# EAGLE design attenuverter (EAGLE 7.6.0)
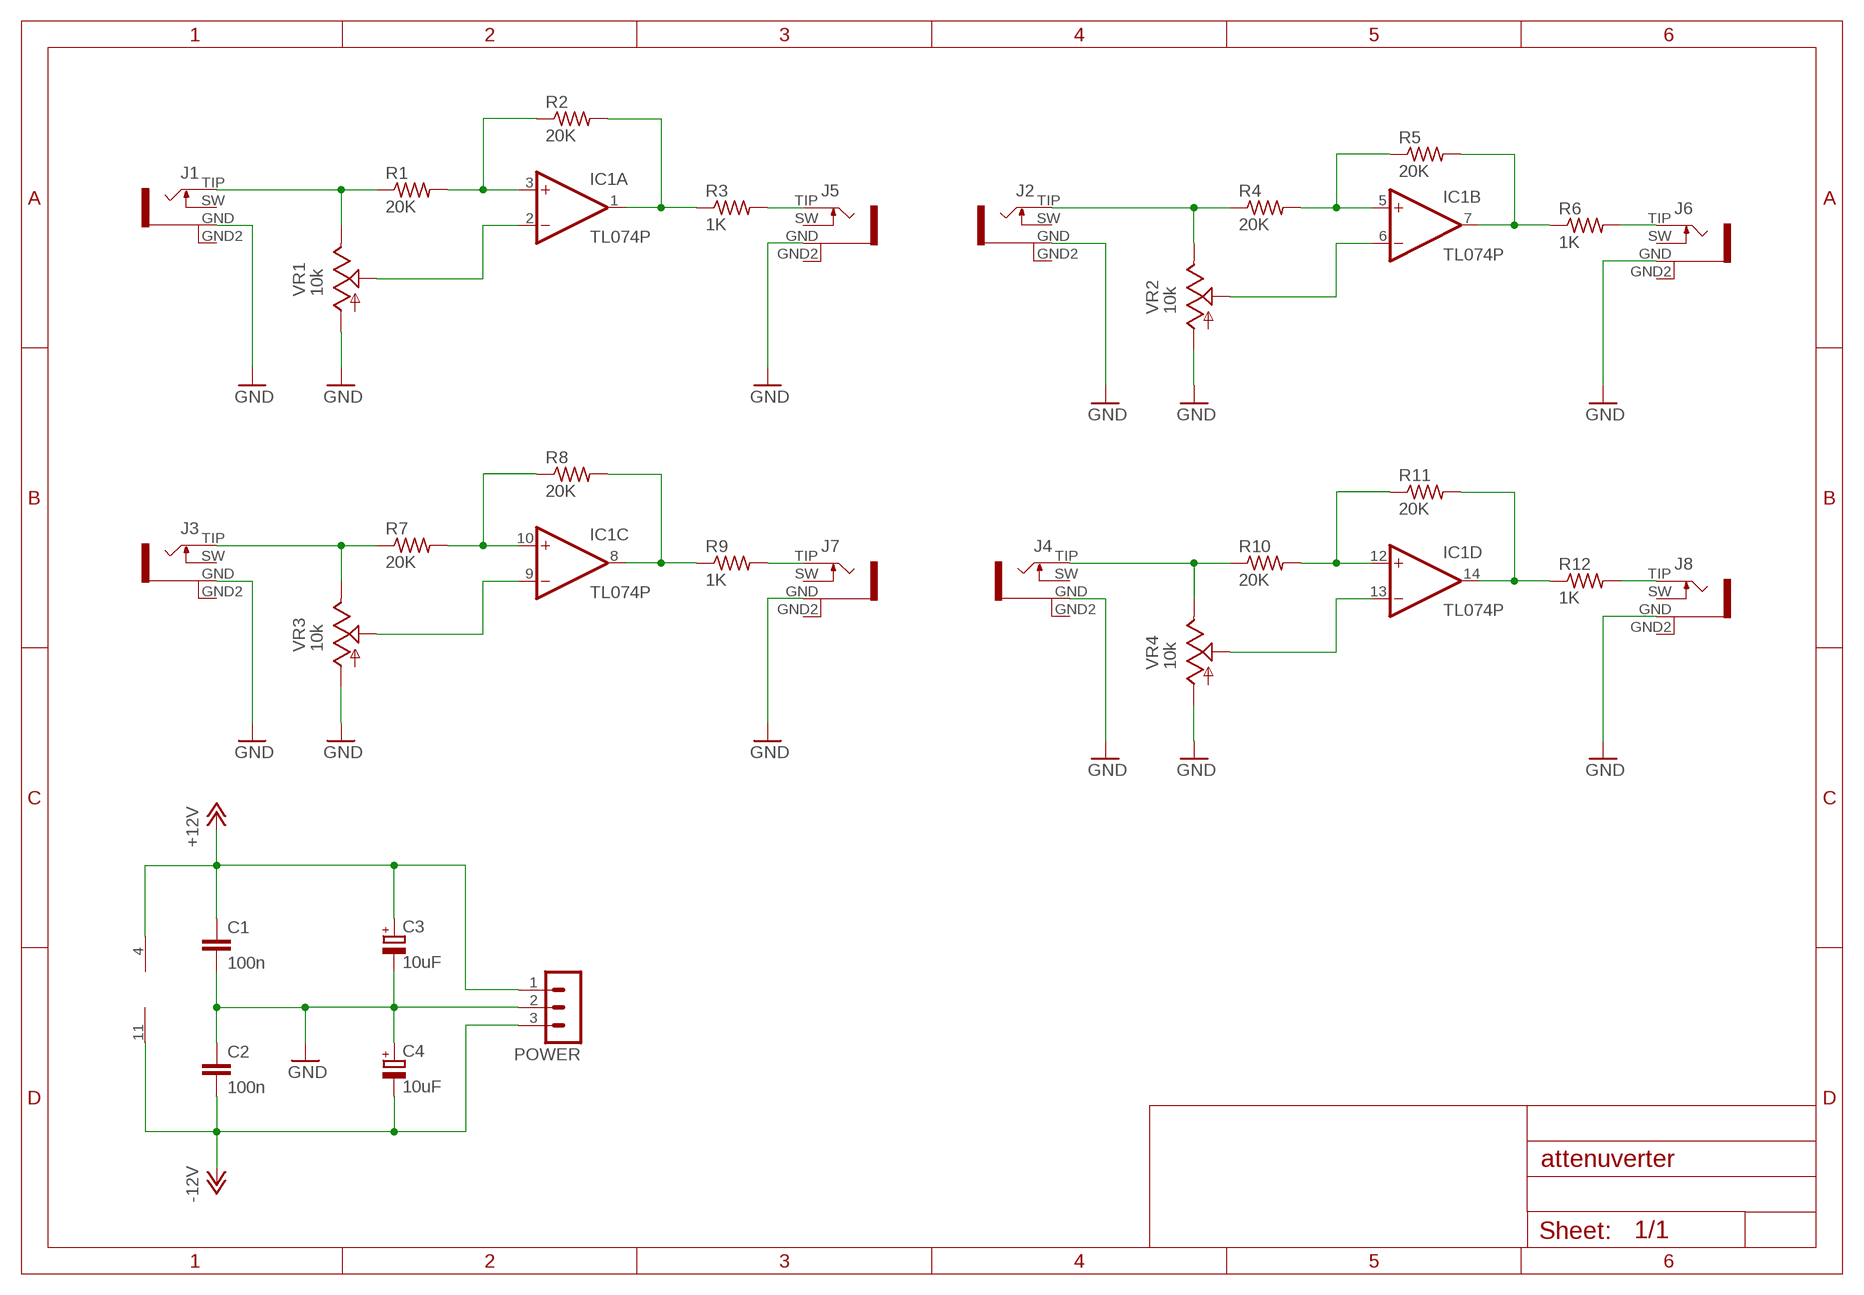
[diagram p0: schematic, sheet 1]

## Parts
C1  100n  C-EU025-025X050  [C025-025X050]
C2  100n  C-EU025-025X050  [C025-025X050]
C3  10uF  CPOL-EUE2,5-6E  [E2,5-6E]
C4  10uF  CPOL-EUE2,5-6E  [E2,5-6E]
IC1  TL074P  [DIL14]
J1  PJ301WQP  [THONK_JACK_P]
J2  PJ301WQP  [THONK_JACK_P]
J3  PJ301WQP  [THONK_JACK_P]
J4  PJ301WQP  [THONK_JACK_P]
J5  PJ301WQP  [THONK_JACK_P]
J6  PJ301WQP  [THONK_JACK_P]
J7  PJ301WQP  [THONK_JACK_P]
J8  PJ301WQP  [THONK_JACK_P]
POWER  MA03-1  [MA03-1]
R1  20K  R-US_0207/10  [0207/10]
R2  20K  R-US_0207/10  [0207/10]
R3  1K  R-US_0207/10  [0207/10]
R4  20K  R-US_0207/10  [0207/10]
R5  20K  R-US_0207/10  [0207/10]
R6  1K  R-US_0207/10  [0207/10]
R7  20K  R-US_0207/10  [0207/10]
R8  20K  R-US_0207/10  [0207/10]
R9  1K  R-US_0207/10  [0207/10]
R10  20K  R-US_0207/10  [0207/10]
R11  20K  R-US_0207/10  [0207/10]
R12  1K  R-US_0207/10  [0207/10]
VR1  10k  9MM_SNAP-IN_POT_  [9MM_SNAP-IN_POT]
VR2  10k  9MM_SNAP-IN_POT_  [9MM_SNAP-IN_POT]
VR3  10k  9MM_SNAP-IN_POT_  [9MM_SNAP-IN_POT]
VR4  10k  9MM_SNAP-IN_POT_  [9MM_SNAP-IN_POT]

## Nets
+12V: C1.1 C3.+ IC1.4(P:V+) POWER.1
-12V: C2.2 C4.- IC1.11(P:V-) POWER.3
GND: C1.2 C2.1 C3.- C4.+ J1.GND J2.GND J3.GND J4.GND J5.GND J6.GND J7.GND J8.GND POWER.2 VR1.1(A) VR2.1(A) VR3.1(A) VR4.1(A)
N$1: J1.TIP R1.1 VR1.3(E)
N$2: J3.TIP R7.1 VR3.3(E)
N$3: IC1.10(C:+IN) R7.2 R8.1
N$4: IC1.3(A:+IN) R1.2 R2.1
N$5: IC1.1(A:OUT) R2.2 R3.1
N$6: J5.TIP R3.2
N$7: IC1.8(C:OUT) R8.2 R9.1
N$8: J7.TIP R9.2
N$9: IC1.12(D:+IN) R10.2 R11.1
N$10: J4.TIP R10.1 VR4.3(E)
N$11: IC1.5(B:+IN) R4.2 R5.1
N$12: J2.TIP R4.1 VR2.3(E)
N$13: IC1.7(B:OUT) R5.2 R6.1
N$14: J6.TIP R6.2
N$15: IC1.14(D:OUT) R11.2 R12.1
N$16: J8.TIP R12.2
N$17: IC1.2(A:-IN) VR1.2(S)
N$18: IC1.9(C:-IN) VR3.2(S)
N$19: IC1.6(B:-IN) VR2.2(S)
N$20: IC1.13(D:-IN) VR4.2(S)
Unconnected: J1.GND2 J1.SW J2.GND2 J2.SW J3.GND2 J3.SW J4.GND2 J4.SW J5.GND2 J5.SW J6.GND2 J6.SW J7.GND2 J7.SW J8.GND2 J8.SW

## Library data of the parts
C1 C2 = resistor:C-EU: CAPACITOR, European symbol
C3 C4 = resistor:CPOL-EU: POLARIZED CAPACITOR, European symbol
IC1 = linear:TL074: OP AMP
J1-J8 = tim:PJ301
POWER = con-lstb:MA03-1: PIN HEADER; OC_FARNELL: unknown; OC_NEWARK: unknown
R1-R12 = resistor:R-US_: RESISTOR, American symbol
VR1-VR4 = MusicThingModular:9MM_SNAP-IN_POT: 9mm vertical snap-in pot, Alpha / Panasonic style

## Board
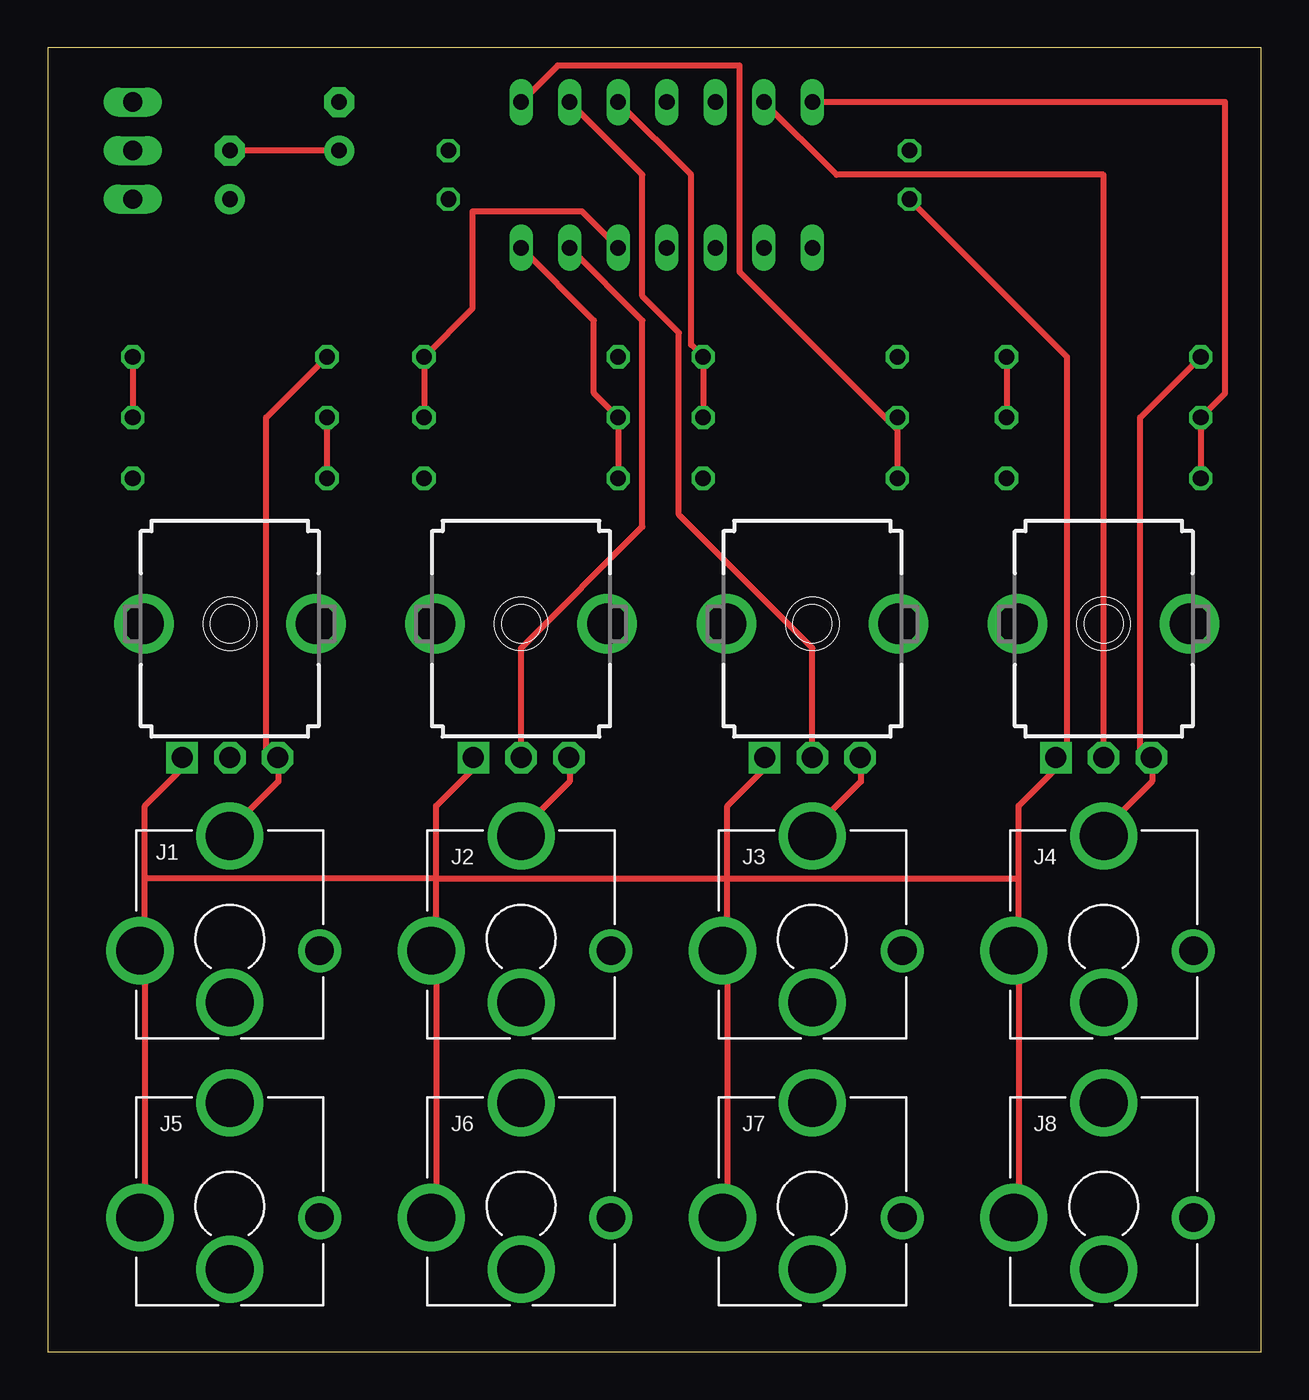
[diagram p1: board, top side]
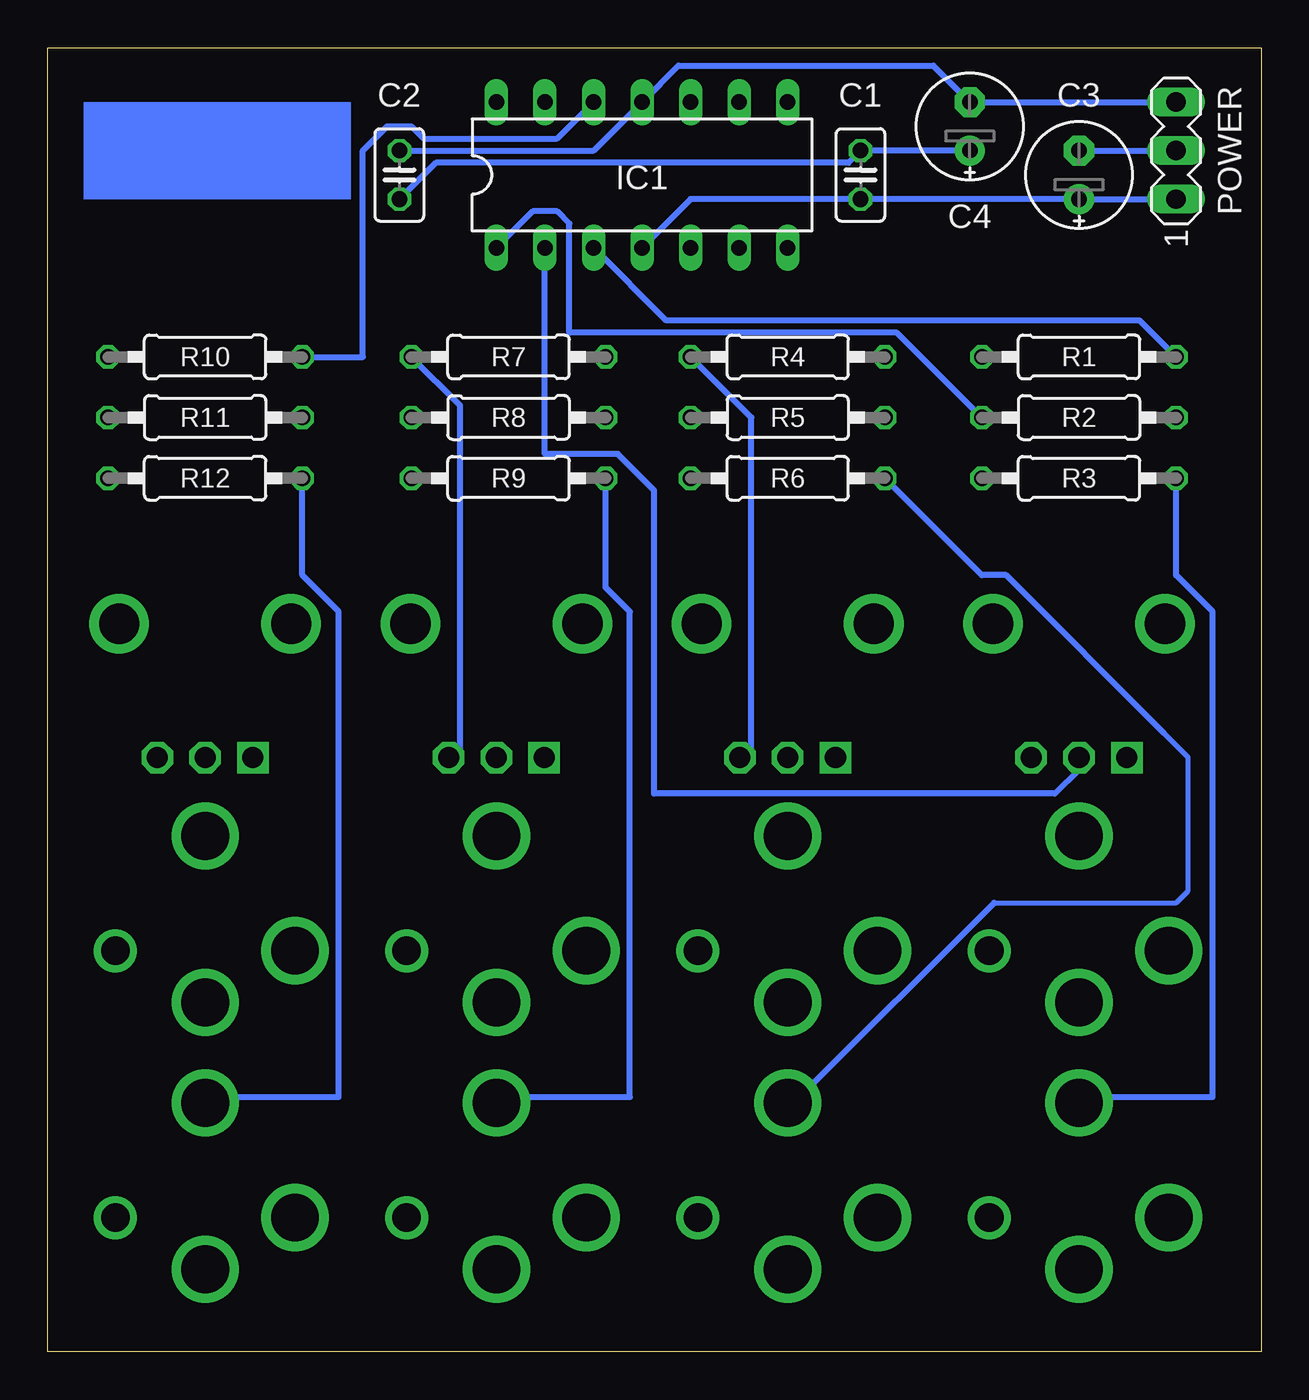
[diagram p2: board, bottom side, seen from below]

Size 63.48 x 68.25 mm. Coordinates in mm from the lower left corner, seen from the top.
Outline: 0,0 63.48,0 63.48,68.25 0,68.25 0,0
Copper layers (1*16): Top 0.035559375mm / dielectric 1.6mm / Bottom 0.035559375mm
Design rules "jlcpcb2layer *": minimum track width 12mil, minimum drill 12mil, track to track 12mil, track to pad 12mil, pad to pad 12mil, via to via 12mil, smd to smd 12mil, copper to edge 12mil, drill to drill 12mil, minimum pad ring 5mil, minimum via ring 3mil, stop-mask expansion 2.5mil, vias tented up to drill 0mil, thermal gap 10mil

### Footprints (pad centres in the part's own frame; a part is rotated, then mirrored left to right if it is on the bottom)
C025-025X050 = drill 0.813 octagon: 1 -1.27,0; 2 1.27,0
E2,5-6E = drill 0.813 pad 1.575: + -1.27,0 | drill 0.813 pad 1.575 octagon: - 1.27,0
DIL14 = drill 0.813 long: 1 -7.62,-3.81; 2 -5.08,-3.81; 3 -2.54,-3.81; 4 0,-3.81; 5 2.54,-3.81; 6 5.08,-3.81; 7 7.62,-3.81; 8 7.62,3.81; 9 5.08,3.81; 10 2.54,3.81; 11 0,3.81; 12 -2.54,3.81; 13 -5.08,3.81; 14 -7.62,3.81
THONK_JACK_P = drill 2.5: GND -4.7,-0.6; SW 0,-3.3; TIP 0,5.4 | drill 1.5: GND2 4.7,-0.6
MA03-1 = drill 1.016 long: 1 -2.54,0; 2 0,0; 3 2.54,0
0207/10 = drill 0.813 octagon: 1 -5.08,0; 2 5.08,0
9MM_SNAP-IN_POT = drill 1.1 square: 1 -2.5,-7 | drill 1.1 octagon: 2 0,-7; 3 2.5,-7 | drill 2.1 pad 2.794: CHASSIS1 -4.5,0; CHASSIS2 4.5,0

### Placement (x,y rotation side)
C1  20.95,61.59 90 bottom
C2  45.09,61.59 90 bottom
C3  9.53,61.59 90 bottom
C4  15.24,64.14 90 bottom
IC1  32.38,61.59 0 bottom
J1  9.53,21.59 0 top
J2  24.77,21.59 0 top
J3  40.01,21.59 0 top
J4  55.24,21.59 0 top
J5  9.53,7.62 0 top
J6  24.77,7.62 0 top
J7  40.01,7.62 0 top
J8  55.24,7.62 0 top
POWER  4.45,62.87 90 bottom
R1  9.53,52.07 0 bottom
R2  9.53,48.9 180 bottom
R3  9.53,45.72 0 bottom
R4  24.77,52.07 0 bottom
R5  24.77,48.9 180 bottom
R6  24.77,45.72 0 bottom
R7  39.37,52.07 0 bottom
R8  39.37,48.9 180 bottom
R9  39.37,45.72 0 bottom
R10  55.24,52.07 0 bottom
R11  55.24,48.9 180 bottom
R12  55.24,45.72 0 bottom
VR1  9.53,38.1 0 top
VR2  24.77,38.1 0 top
VR3  40.01,38.1 0 top
VR4  55.24,38.1 0 top

### Tracks (layer width: path | path; a pad name or v marks a point on that pad's centre or on a via)
+12V
  Bottom 0.305: IC1.4 29.84,60.33 C1.1 C3.+ POWER.1
-12V
  Bottom 0.305: POWER.3 C4.- 17.14,67.31 30.48,67.31 IC1.11 34.92,62.87 C2.2
GND
  Top 0.305: C4.+ C3.- | 50.8,24.77 50.8,21.59 J4.GND 50.8,20.95 50.8,7.62 J8.GND | 50.8,24.77 50.8,28.57 52.7,30.48 VR4.1 53.34,31.11 53.34,52.07 C2.1 | 35.56,24.77 35.56,21.59 J3.GND 35.56,20.95 35.56,7.62 J7.GND | 35.56,24.77 35.56,28.57 37.47,30.48 VR3.1 | 5.08,24.77 5.08,21.59 J1.GND 5.08,20.95 5.08,7.62 J5.GND | 5.08,24.77 5.08,28.57 6.99,30.48 VR1.1 | 20.32,24.77 20.32,21.59 J2.GND 20.32,20.95 20.32,7.62 J6.GND | 20.32,24.77 20.32,28.57 22.23,30.48 VR2.1 | 20.32,24.77 5.08,24.77 | 20.32,24.77 35.56,24.77 | 35.56,24.77 50.8,24.77
  Bottom 0.305: C3.- POWER.2 | C4.+ C1.2 21.59,62.23 43.18,62.23 C2.1
N$1
  Top 0.305: R1.1 11.43,48.9 11.43,31.11 VR1.3 12.06,30.48 12.06,29.84 9.53,27.3 J1.TIP
N$2
  Top 0.305: J3.TIP 40.01,27.3 42.55,29.84 42.55,30.48 VR3.3
  Bottom 0.305: R7.1 41.91,49.53 41.91,31.11 VR3.3
N$3
  Top 0.305: R8.1 R7.2 33.66,52.7 33.66,61.59 IC1.10
N$4
  Top 0.305: R1.2 R2.1
  Bottom 0.305: IC1.3 31.11,53.98 6.35,53.98 R1.2
N$5
  Top 0.305: R2.2 R3.1
  Bottom 0.305: IC1.1 38.1,59.69 36.83,59.69 36.2,59.05 36.2,53.34 19.05,53.34 R2.2
N$6
  Bottom 0.305: R3.2 4.45,40.64 2.54,38.73 2.54,13.34 9.53,13.34 J5.TIP
N$7
  Top 0.305: R8.2 44.45,48.26 | 44.45,48.26 R9.1 | IC1.8 26.67,67.31 36.2,67.31 36.2,56.52 44.45,48.26
N$8
  Bottom 0.305: R9.2 34.29,40.01 33.02,38.73 33.02,13.34 40.01,13.34 J7.TIP
N$9
  Top 0.305: R10.2 R11.1
  Bottom 0.305: IC1.12 36.83,63.5 43.81,63.5 44.45,64.14 45.72,64.14 46.99,62.87 46.99,52.07 R10.2
N$10
  Top 0.305: R10.1 57.15,48.9 57.15,31.11 VR4.3 57.78,30.48 57.78,29.84 55.24,27.3 J4.TIP
N$11
  Top 0.305: R5.1 R4.2 22.23,54.61 22.23,59.69 27.94,59.69 IC1.5
N$12
  Top 0.305: J2.TIP 24.77,27.3 27.3,29.84 27.3,30.48 VR2.3
  Bottom 0.305: R4.1 26.67,48.9 26.67,31.11 VR2.3
N$13
  Top 0.305: R6.1 R5.2 28.57,50.16 28.57,53.98 IC1.7
N$14
  Bottom 0.254: 13.97,23.5 4.45,23.5 3.81,24.13 3.81,31.11 5.08,32.38
  Bottom 0.305: R6.2 14.61,40.64 13.34,40.64 5.08,32.38 | 13.97,23.5 24.13,13.34 24.77,13.34 J6.TIP
N$15
  Top 0.305: R12.1 R11.2 61.59,50.16 61.59,65.41 IC1.14
N$16
  Bottom 0.305: R12.2 50.16,40.64 48.26,38.73 48.26,13.34 55.24,13.34 J8.TIP
N$17
  Bottom 0.305: IC1.2 37.47,46.99 33.66,46.99 31.75,45.09 31.75,29.21 10.79,29.21 9.53,30.48 VR1.2
N$18
  Top 0.305: IC1.9 31.11,61.59 31.11,55.24 33.02,53.34 33.02,43.81 40.01,36.83 VR3.2
N$19
  Top 0.305: IC1.6 31.11,53.98 31.11,43.18 24.77,36.83 VR2.2
N$20
  Top 0.305: IC1.13 41.27,61.59 55.24,61.59 VR4.2
(copper drawn outside any net)
  shapes: Bottom area x1

### Text on the board
bStop: Attenuverter / v1.0